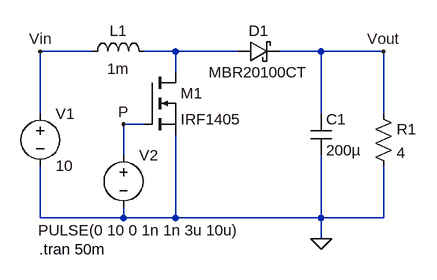
[diagram p0: schematic Boost-converter.asc]
Boost-converter.asc, the LTspice schematic file:
Version 4
SHEET 1 880 680
WIRE -32 -96 -112 -96
WIRE 96 -96 48 -96
WIRE 192 -96 96 -96
WIRE 320 -96 256 -96
WIRE 416 -96 320 -96
WIRE 96 -64 96 -96
WIRE -112 0 -112 -96
WIRE 320 0 320 -96
WIRE 416 0 416 -96
WIRE 48 16 16 16
WIRE 16 64 16 16
WIRE -112 160 -112 80
WIRE 16 160 16 144
WIRE 16 160 -112 160
WIRE 96 160 96 32
WIRE 96 160 16 160
WIRE 320 160 320 64
WIRE 320 160 96 160
WIRE 416 160 416 80
WIRE 416 160 320 160
WIRE 320 192 320 160
FLAG 16 16 P
FLAG 320 192 0
FLAG -112 -96 Vin
FLAG 416 -96 Vout
SYMBOL ind -48 -80 R270
WINDOW 0 32 56 VTop 2
WINDOW 3 5 56 VBottom 2
SYMATTR InstName L1
SYMATTR Value 1m
SYMBOL cap 304 0 R0
SYMATTR InstName C1
SYMATTR Value 200µ
SYMBOL res 400 -16 R0
SYMATTR InstName R1
SYMATTR Value 4
SYMBOL schottky 192 -80 R270
WINDOW 0 32 32 VTop 2
WINDOW 3 0 32 VBottom 2
SYMATTR InstName D1
SYMATTR Value MBR20100CT
SYMATTR Description Diode
SYMATTR Type diode
SYMBOL voltage -112 -16 R0
WINDOW 123 0 0 Left 0
WINDOW 39 0 0 Left 0
SYMATTR InstName V1
SYMATTR Value 10
SYMBOL voltage 16 48 R0
WINDOW 3 -131 131 Left 2
WINDOW 123 0 0 Left 0
WINDOW 39 0 0 Left 0
SYMATTR InstName V2
SYMATTR Value PULSE(0 10 0 1n 1n 3u 10u)
SYMBOL nmos 48 -64 R0
SYMATTR InstName M1
SYMATTR Value IRF1405
TEXT -114 208 Left 2 !.tran 50m

The netlist it stands for:
* Boost-converter.asc
L1 Vin N001 1m
C1 Vout 0 200µ
R1 Vout 0 4
D1 N001 Vout MBR20100CT
V1 Vin 0 10
V2 P 0 PULSE(0 10 0 1n 1n 3u 10u)
M1 N001 P 0 0 IRF1405
.model D D
.lib standard.dio
.model NMOS NMOS
.model PMOS PMOS
.lib standard.mos
.tran 50m
.backanno
.end